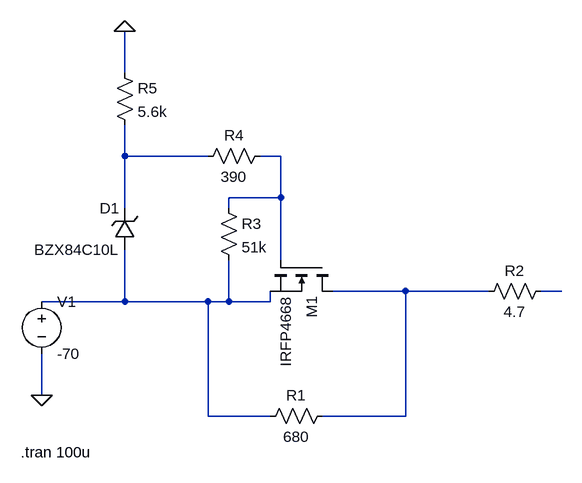
[diagram p0: schematic Draft1.asc]
Draft1.asc, the LTspice schematic file:
Version 4
SHEET 1 1204 680
WIRE 112 -144 112 -208
WIRE 112 -16 112 -64
WIRE 240 -16 112 -16
WIRE 352 -16 320 -16
WIRE 352 48 352 -16
WIRE 352 48 272 48
WIRE 112 64 112 -16
WIRE 272 64 272 48
WIRE 352 144 352 48
WIRE 544 192 432 192
WIRE 672 192 544 192
WIRE 784 192 752 192
WIRE 112 208 112 128
WIRE 112 208 -16 208
WIRE 240 208 112 208
WIRE 272 208 272 144
WIRE 272 208 240 208
WIRE 336 208 336 192
WIRE 336 208 272 208
WIRE -16 352 -16 288
WIRE 240 384 240 208
WIRE 336 384 240 384
WIRE 544 384 544 192
WIRE 544 384 416 384
FLAG -16 352 0
FLAG 112 -208 0
DATAFLAG 480 384 ""
DATAFLAG 352 80 ""
DATAFLAG 64 208 ""
DATAFLAG 112 16 ""
SYMBOL nmos 432 144 R90
SYMATTR InstName M1
SYMATTR Value IRFP4668
SYMBOL res 432 368 R90
WINDOW 0 0 56 VBottom 2
WINDOW 3 32 56 VTop 2
SYMATTR InstName R1
SYMATTR Value 680
SYMBOL res 768 176 R90
WINDOW 0 0 56 VBottom 2
WINDOW 3 32 56 VTop 2
SYMATTR InstName R2
SYMATTR Value 4.7
SYMBOL voltage -16 192 R0
WINDOW 123 0 0 Left 0
WINDOW 39 0 0 Left 0
SYMATTR InstName V1
SYMATTR Value -70
SYMBOL res 256 48 R0
SYMATTR InstName R3
SYMATTR Value 51k
SYMBOL res 336 -32 R90
WINDOW 0 0 56 VBottom 2
WINDOW 3 32 56 VTop 2
SYMATTR InstName R4
SYMATTR Value 390
SYMBOL zener 128 128 R180
WINDOW 0 24 64 Left 2
WINDOW 3 24 0 Left 2
SYMATTR InstName D1
SYMATTR Value BZX84C10L
SYMATTR Description Diode
SYMATTR Type diode
SYMBOL res 96 -160 R0
SYMATTR InstName R5
SYMATTR Value 5.6k
TEXT -48 440 Left 2 !.tran 100u

The netlist it stands for:
* Draft1.asc
M1 N003 N002 N005 N005 IRFP4668
R1 N003 N005 680
R2 N004 N003 4.7
V1 N005 0 -70
R3 N002 N005 51k
R4 N002 N001 390
D1 N005 N001 BZX84C10L
R5 0 N001 5.6k
.model D D
.lib standard.dio
.model NMOS NMOS
.model PMOS PMOS
.lib standard.mos
.tran 100u
.backanno
.end